# EAGLE design Smarty-TOP (EAGLE 9.5.1)
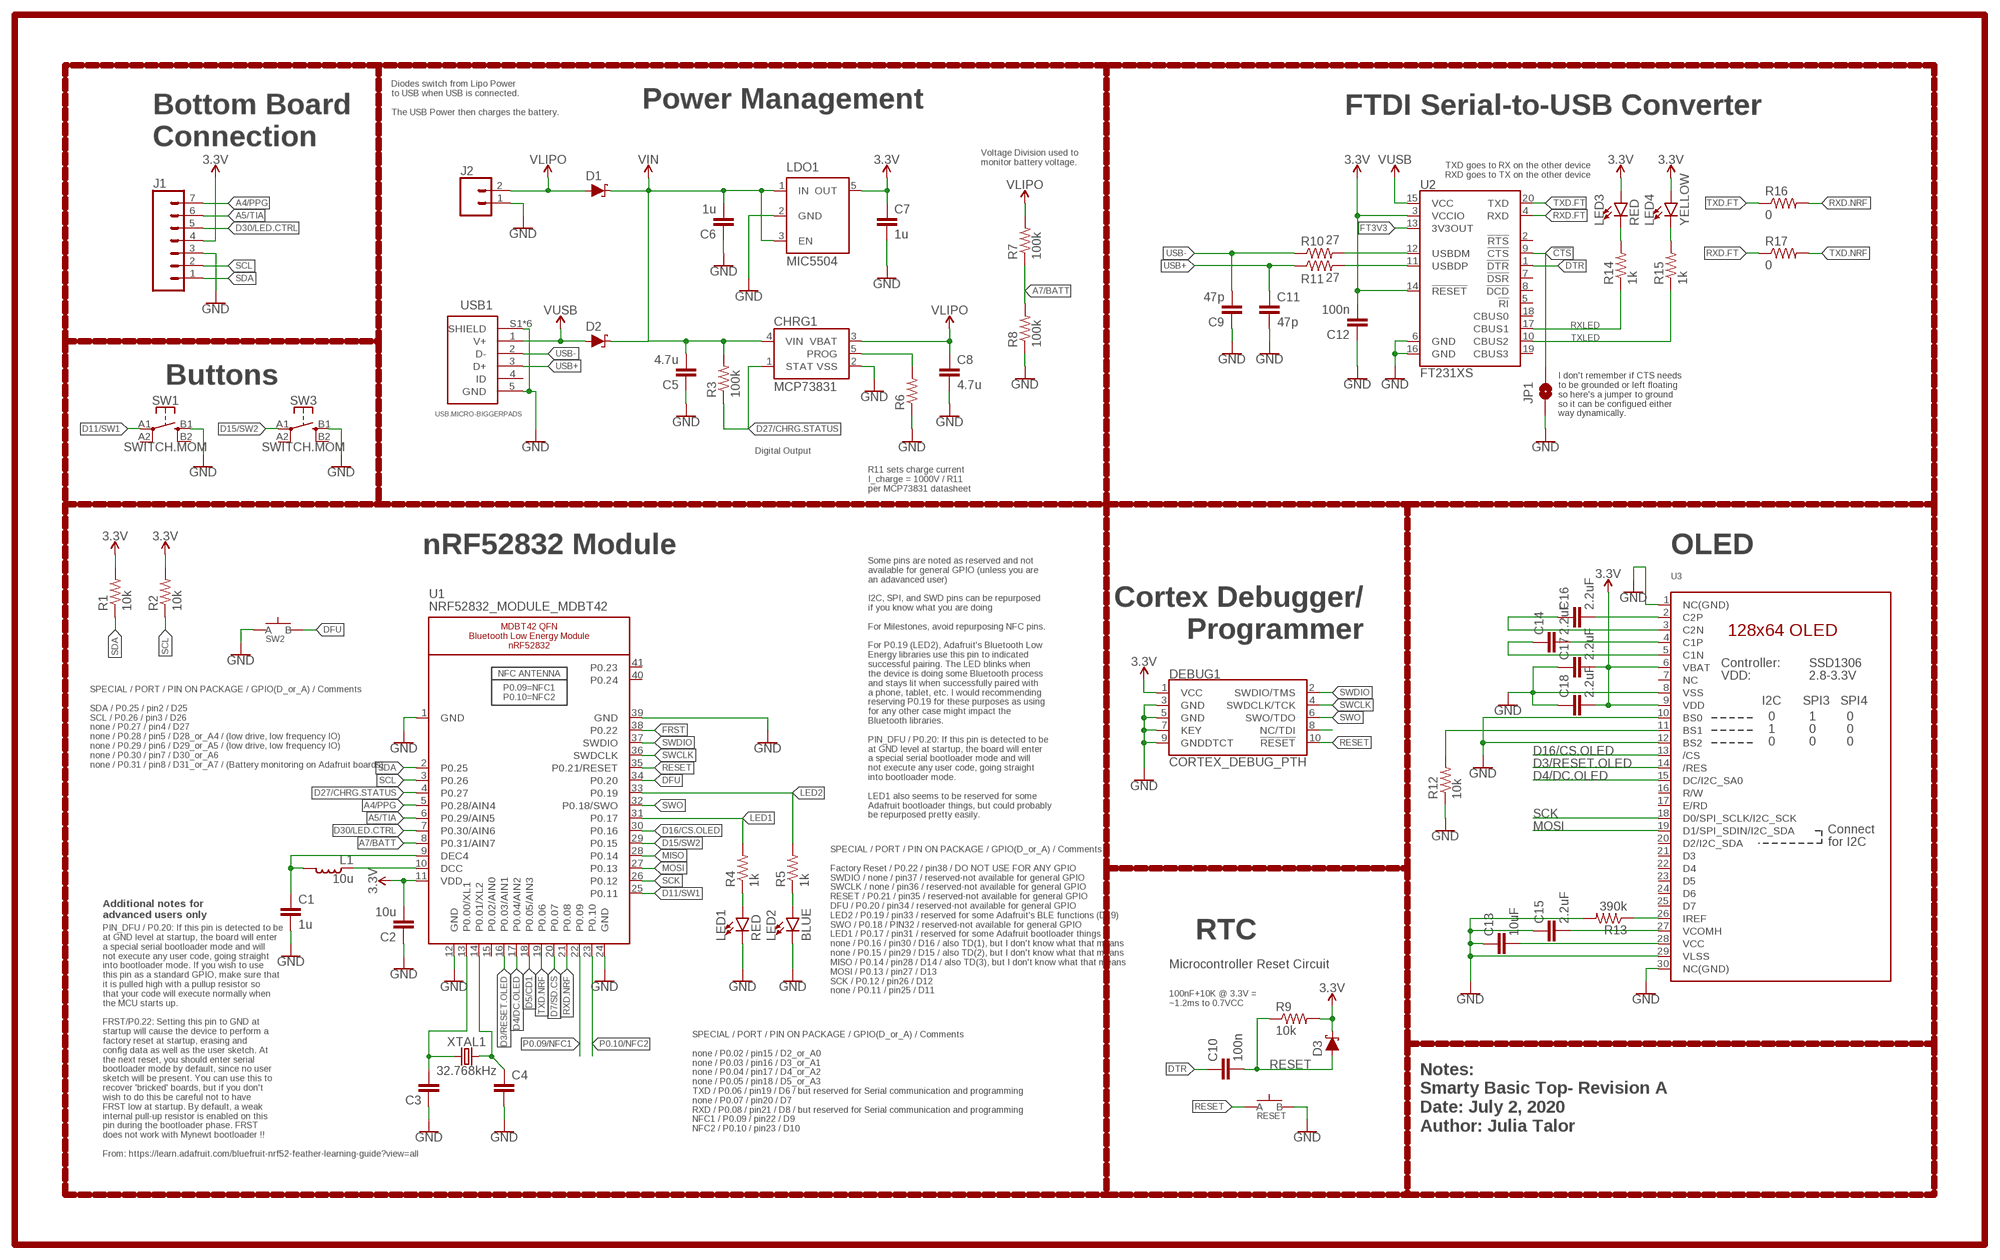
[diagram p0: schematic, sheet 1]

## Parts
C1  1u  CAPACITOR0603  [C0603]
C2  10u  CAPACITOR0805  [C0805]
C3  CAPACITOR0603  [C0603]
C4  CAPACITOR0603  [C0603]
C5  4.7u  CAPACITOR0603  [C0603]
C6  1u  CAPACITOR0603  [C0603]
C7  1u  CAPACITOR0603  [C0603]
C8  4.7u  CAPACITOR0603  [C0603]
C9  47p  CAPACITOR0603  [C0603]
C10  100n  CAPACITOR0603  [C0603]
C11  47p  CAPACITOR0603  [C0603]
C12  100n  CAPACITOR0603  [C0603]
C13  10uF  CAPACITOR0603  [C0603]
C14  2.2uF  CAPACITOR0402  [C0402]
C15  2.2uF  CAPACITOR0603  [C0603]
C16  2.2uF  CAPACITOR0402  [C0402]
C17  2.2uF  CAPACITOR0402  [C0402]
C18  2.2uF  CAPACITOR0402  [C0402]
CHRG1  MCP73831  [SOT23-5]
D1  SCHOTTKY-USC  [USC]
D2  SCHOTTKY-USC  [USC]
D3  SCHOTTKY-USC  [USC]
DEBUG1  CORTEX_DEBUG_PTH  [2X5-PTH-1.27MM]
J1  CONN_07-1.27MM  [1X07_1.27MM]
J2  CONN_02  [1X02]
JP1  JUMPER-SMT_2_NO_SILK  [SMT-JUMPER_2_NO_SILK]
L1  10u  INDUCTOR0603  [L0603]
LDO1  MIC5504  [SOT23-5]
LED1  RED  LED0603  [LED-0603]
LED2  BLUE  LED0603  [LED-0603]
LED3  RED  LED0603  [LED-0603]
LED4  YELLOW  LED0603  [LED-0603]
R1  10k  RESISTOR0603  [R0603]
R2  10k  RESISTOR0603  [R0603]
R3  100k  RESISTOR0603  [R0603]
R4  1k  RESISTOR0603  [R0603]
R5  1k  RESISTOR0603  [R0603]
R6  RESISTOR0603  [R0603]
R7  100k  RESISTOR0603  [R0603]
R8  100k  RESISTOR0603  [R0603]
R9  10k  RESISTOR0603  [R0603]
R10  27  RESISTOR0603  [R0603]
R11  27  RESISTOR0603  [R0603]
R12  10k  RESISTOR0603  [R0603]
R13  390k  RESISTOR0603  [R0603]
R14  1k  RESISTOR0603  [R0603]
R15  1k  RESISTOR0603  [R0603]
R16  0  RESISTOR0603  [R0603]
R17  0  RESISTOR0603  [R0603]
RESET  SPST-PTS830GG140-COPY.1-3  [BUTTON-GULLWING]
SW1  SWITCH.MOM  [TACTILE_SWITCH_SMD_6.2MM_TALL]
SW2  SPST-PTS830GG140-COPY.1-3  [BUTTON-GULLWING]
SW3  SWITCH.MOM  [TACTILE_SWITCH_SMD_6.2MM_TALL]
U1  NRF52832_MODULE_MDBT42  [BLE_MODULE_RAYTAC_MDBT42]
U2  FT231XS  [SSOP20_L]
U3  DISP_OLED_UG-2864HSWEG01-NO-WRAPAROUND  [UG-2864HSWEG01_0.96IN_NO-WRAPAROUND]
USB1  USB.MICRO-BIGGERPADS  [USB-MICRO-01.BIGGERPADS]
XTAL1  32.768kHz  CRYSTALECS-.327-12.5-12-C-TR  [2-SMD.NOLEAD.2.0MMTO1.2MM]

## Nets
3.3V: C2.2 C7.1 C12.2 C17.2 C18.2 D3.-(C) DEBUG1.1(VCC) J1.4 LDO1.5(OUT) LED3.A LED4.A R1.2 R2.2 R9.2 U1.11(VDD) U2.3(VCCIO) U2.14(!RESET) U3.6(VBAT) U3.9(VDD)
!CTS: JP1.2 U2.9(!CTS)
A4/PPG: J1.7 U1.5(P0.28/AIN4)
A5/TIA: J1.6 U1.6(P0.29/AIN5)
A7/BATT: R7.1 R8.2 U1.8(P0.31/AIN7)
D3/RESET.OLED: U1.16(P0.03/AIN1) U3.14(/RES)
D4/DC.OLED: U1.17(P0.04/AIN2) U3.15(DC/I2C_SA0)
D5/CD1: U1.18(P0.05/AIN3)
D7/SD.CS: U1.20(P0.07)
D11/SW1: SW1.A1 U1.25(P0.11)
D15/SW2: SW3.A1 U1.29(P0.15)
D16/CS.OLED: U1.30(P0.16) U3.13(/CS)
D27/CHRG.STATUS: CHRG1.1(STAT) R3.1 U1.4(P0.27)
D30/LED.CTRL: J1.5 U1.7(P0.30/AIN6)
DFU: SW2.3(B) U1.34(P0.20)
DTR: C10.1 U2.1(!DTR)
FRST: U1.38(P0.22)
FT3V3: U2.13(3V3OUT)
GND: C1.2 C2.1 C3.1 C4.2 C5.1 C6.1 C7.2 C8.2 C9.1 C11.2 C12.1 C13.1 C15.1 C17.1 C18.1 CHRG1.2(VSS) DEBUG1.3(GND) DEBUG1.5(GND) DEBUG1.7(KEY) DEBUG1.9(GNDDTCT) J1.3 J2.1 JP1.1 LDO1.2(GND) LED1.C LED2.C R6.1 R8.1 R12.1 R13.2 RESET.3(B) SW1.B1 SW2.1(A) SW3.B1 U1.1(GND) U1.12(GND) U1.24(GND) U1.39(GND) U2.6(GND) U2.16(GND) U3.1(NC(GND)) U3.8(VSS) U3.10(BS0) U3.12(BS2) U3.29(VLSS) U3.30(NC(GND)) USB1.5(GND) USB1.S1(SHIELD) USB1.S2(SHIELD) USB1.S3(SHIELD) USB1.S4(SHIELD) USB1.S5(SHIELD) USB1.S6(SHIELD)
LED1: R4.2 U1.31(P0.17)
LED2: R5.2 U1.33(P0.19)
MISO: U1.28(P0.14)
MOSI: U1.27(P0.13) U3.19(D1/SPI_SDIN/I2C_SDA)
N$1: R12.2 U3.11(BS1)
N$2: R13.1 U3.26(IREF)
N$3: C16.2 U3.2(C2P)
N$4: CHRG1.5(PROG) R6.2
N$5: C16.1 U3.3(C2N)
N$7: C14.2 U3.4(C1P)
N$8: C14.1 U3.5(C1N)
N$11: R10.2 U2.12(USBDM)
N$12: R11.2 U2.11(USBDP)
N$13: C13.2 U3.28(VCC)
N$14: LED3.C R14.2
N$15: C15.2 U3.27(VCOMH)
N$16: LED4.C R15.2
N$26: C3.2 U1.13(P0.00/XL1) XTAL1.P$1
N$27: C4.1 U1.14(P0.01/XL2) XTAL1.P$2
N$28: LED1.A R4.1
N$29: LED2.A R5.1
N$30: L1.1 U1.10(DCC)
N$31: C1.1 L1.2 U1.9(DEC4)
N$32: DEBUG1.8(NC/TDI)
P0.09/NFC1: U1.22(P0.09)
P0.10/NFC2: U1.23(P0.10)
RESET: C10.2 D3.+(A) DEBUG1.10(!RESET) R9.1 RESET.1(A) U1.35(P0.21/RESET)
RXD.FT: R17.1 U2.4(RXD)
RXD.NRF: R16.2 U1.21(P0.08)
RXLED: R14.1 U2.17(CBUS1)
SCK: U1.26(P0.12) U3.18(D0/SPI_SCLK/I2C_SCK)
SCL: J1.2 R2.1 U1.3(P0.26)
SDA: J1.1 R1.1 U1.2(P0.25)
SWCLK: DEBUG1.4(SWDCLK/TCK) U1.36(SWDCLK)
SWDIO: DEBUG1.2(SWDIO/TMS) U1.37(SWDIO)
SWO: DEBUG1.6(SWO/TDO) U1.32(P0.18/SWO)
TXD.FT: R16.1 U2.20(TXD)
TXD.NRF: R17.2 U1.19(P0.06)
TXLED: R15.1 U2.10(CBUS2)
USB+: C11.1 R11.1 USB1.3(D+)
USB-: C9.2 R10.1 USB1.2(D-)
V_USB: D2.+(A) U2.15(VCC) USB1.1(V+) ; supply symbol labelled VUSB
VIN: C5.2 C6.2 CHRG1.4(VIN) D1.-(C) D2.-(C) LDO1.1(IN) LDO1.3(EN) R3.2
VLIPO: C8.1 CHRG1.3(VBAT) D1.+(A) J2.2 R7.2
Unconnected: SW1.A2 SW1.B2 SW3.A2 SW3.B2 U1.15(P0.02/AIN0) U1.40(P0.24) U1.41(P0.23) U2.2(!RTS) U2.5(!RI) U2.7(!DSR) U2.8(!DCD) U2.18(CBUS0) U2.19(CBUS3) U3.7(NC) U3.16(R/W) U3.17(E/RD) U3.20(D2/I2C_SDA) U3.21(D3) U3.22(D4) U3.23(D5) U3.24(D6) U3.25(D7) USB1.4(ID)

## Notes on the sheet
- Power Management
- Diodes switch from Lipo Power 
  to USB when USB is connected.
  
  The USB Power then charges the battery.
- FTDI Serial-to-USB Converter
- Bottom Board 
  Connection
- Voltage Division used to 
  monitor battery voltage.
- TXD goes to RX on the other device
  RXD goes to TX on the other device
- Buttons
- I don't remember if CTS needs
  to be grounded or left floating
  so here's a jumper to ground
  so it can be configued either
  way dynamically.
- Digital Output
- R11 sets charge current
  I_charge = 1000V / R11
  per MCP73831 datasheet
- nRF52832 Module | OLED
- Cortex Debugger/
  Programmer
- SPECIAL / PORT / PIN ON PACKAGE / GPIO(D_or_A) / Comments
  
  SDA / P0.25 / pin2 / D25
  SCL / P0.26 / pin3 / D26
  none / P0.27 / pin4 / D27
  none / P0.28 / pin5 / D28_or_A4 / (low drive, low frequency IO)
  none / P0.29 / pin6 / D29_or_A5 / (low drive, low frequency IO)
  none / P0.30 / pin7 / D30_or_A6
  none / P0.31 / pin8 / D31_or_A7 / (Battery monitoring on Adafruit boards)
- Some pins are noted as reserved and not
  available for general GPIO (unless you are
  an adavanced user)
  
  I2C, SPI, and SWD pins can be repurposed
  if you know what you are doing
  
  For Milestones, avoid repurposing NFC pins.
  
  For P0.19 (LED2), Adafruit's Bluetooth Low
  Energy libraries use this pin to indicated
  successful pairing. The LED blinks when
  the device is doing some Bluetooth process
  and stays lit when successfully paired with
  a phone, tablet, etc. I would recommending
  reserving P0.19 for these purposes as using
  for any other case might impact the
  Bluetooth libraries.
  
  PIN_DFU / P0.20: If this pin is detected to be
  at GND level at startup, the board will enter
  a special serial bootloader mode and will
  not execute any user code, going straight
  into bootloader mode.
  
  LED1 also seems to be reserved for some
  Adafruit bootloader things, but could probably
  be repurposed pretty easily.
- Additional notes for
  advanced users only
- RTC
- Microcontroller Reset Circuit
- SPECIAL / PORT / PIN ON PACKAGE / GPIO(D_or_A) / Comments
  
  Factory Reset / P0.22 / pin38 / DO NOT USE FOR ANY GPIO
  SWDIO / none / pin37 / reserved-not available for general GPIO
  SWCLK / none / pin36 / reserved-not available for general GPIO
  RESET / P0.21 / pin35 / reserved-not available for general GPIO
  DFU / P0.20 / pin34 / reserved-not available for general GPIO
  LED2 / P0.19 / pin33 / reserved for some Adafruit's BLE functions (D19)
  SWO / P0.18 / PIN32 / reserved-not available for general GPIO
  LED1 / P0.17 / pin31 / reserved for some Adafruit bootloader things
  none / P0.16 / pin30 / D16 / also TD(1), but I don't know what that means
  none / P0.15 / pin29 / D15 / also TD(2), but I don't know what that means
  MISO / P0.14 / pin28 / D14 / also TD(3), but I don't know what that means
  MOSI / P0.13 / pin27 / D13
  SCK / P0.12 / pin26 / D12
  none / P0.11 / pin25 / D11
- 100nF+10K @ 3.3V =
  ~1.2ms to 0.7VCC
- SPECIAL / PORT / PIN ON PACKAGE / GPIO(D_or_A) / Comments
  
  none / P0.02 / pin15 / D2_or_A0
  none / P0.03 / pin16 / D3_or_A1
  none / P0.04 / pin17 / D4_or_A2
  none / P0.05 / pin18 / D5_or_A3
  TXD / P0.06 / pin19 / D6 / but reserved for Serial communication and programming
  none / P0.07 / pin20 / D7
  RXD / P0.08 / pin21 / D8 / but reserved for Serial communication and programming
  NFC1 / P0.09 / pin22 / D9
  NFC2 / P0.10 / pin23 / D10
- Notes:
  Smarty Basic Top- Revision A
  Date: July 2, 2020
  Author: Julia Talor
- PIN_DFU / P0.20: If this pin is detected to be
  at GND level at startup, the board will enter
  a special serial bootloader mode and will
  not execute any user code, going straight
  into bootloader mode. If you wish to use
  this pin as a standard GPIO, make sure that
  it is pulled high with a pullup resistor so
  that your code will execute normally when
  the MCU starts up.
  
  FRST/P0.22: Setting this pin to GND at
  startup will cause the device to perform a
  factory reset at startup, erasing and
  config data as well as the user sketch. At
  the next reset, you should enter serial
  bootloader mode by default, since no user
  sketch will be present. You can use this to
  recover 'bricked' boards, but if you don't
  wish to do this be careful not to have
  FRST low at startup. By default, a weak
  internal pull-up resistor is enabled on this
  pin during the bootloader phase. FRST
  does not work with Mynewt bootloader !!
  
  From: https://learn.adafruit.com/bluefruit-nrf52-feather-learning-guide?view=all

## Library data of the parts
C1-C18 = LinnesLab-Passives:CAPACITOR
CHRG1 = LinnesLab-Power:MCP73831: MCP73831T Li-Ion, Li-Pol Controller Miniature single cell, fully integrated Li-Ion, Li-polymer charge management controller Datasheet <http://ww1.microchip.com/downloads/en/DeviceDoc/20001984g.pdf> SparkFun Products: SparkFun ESP32 Thing <https://www.sparkfun.com/products/13907> SparkFun 9DoF Razor IMU M0 <https://www.sparkfun.com/products/14001>; PROD_ID: IC-09995
D1-D3 = LinnesLab-DiscreteSemi:SCHOTTKY: Schottky diode A Schottky diode is a semiconductor diode which has a low forward voltage drop and a very fast switching action. Example: Digi-Key Part Number: RB161MM-20CT-ND
DEBUG1 = LinnesLab-Connectors:CORTEX_DEBUG: Cortex Debug Connector - 10 pin Supports JTAG debug, Serial Wire debug, and Serial Wire Viewer. PTH and SMD connector options available. General Connector Information <http://infocenter.arm.com/help/topic/com.arm.doc.faqs/attached/13634/cortex_debug_connectors.pdf> Products: PTH Connector <http://www.digikey.com/product-detail/en/cnc-tech/3220-10-0100-00/1175-1627-ND/3883661> -via Digi-Key SparkFun PSoc <https://www.sparkfun.com/products/13229> SparkFun T <https://www.sparkfun.com/products/13810>
J1 = LinnesLab-Connectors:CONN_07: Multi connection point. Often used as Generic Header-pin footprint for 0.1 inch spaced/style header connections On any of the 0.1 inch spaced packages, you can populate with these: Break Away Headers - Straight <https://www.sparkfun.com/products/116> (PRT-00116) Break Away Male Headers - Right Angle <https://www.sparkfun.com/products/553> (PRT-00553) Female Headers <https://www.sparkfun.com/products/115> (PRT-00115) Break Away Headers - Machine Pin <https://www.sparkfun.com/products/117> (PRT-00117) Break Away Female Headers - Swiss Machine Pin <https://www.sparkfun.com/products/743> (PRT-00743) For SCREWTERMINALS and SPRING TERMINALS visit here: Screw Terimnals on SparkFun.com <https://www.sparkfun.com/search/results?term=Screw+Terminals> (5mm/3.5mm/2.54mm spacing) This device is also useful as a general connection point to wire up your design to another part of your project. Our various solder wires solder well into these plated through hole pads. Hook-Up Wire - Assortment (Stranded, 22 AWG) <https://www.sparkfun.com/products/11375> (PRT-11375) Hook-Up Wire - Assortment (Solid Core, 22 AWG) <https://www.sparkfun.com/products/11367> (PRT-11367) View the entire wire category on our website here <https://www.sparkfun.com/categories/141> Special notes: Molex polarized connector foot print use with SKU : PRT-08231 with associated crimp pins and housings. 1MM SMD Version SKU: PRT-10208 NOTES ON THE VARIANTS LOCK and LOCK_LONGPADS... This footprint was designed to help hold the alignment of a through-hole component (i.e. 6-pin header) while soldering it into place. You may notice that each hole has been shifted either up or down by 0.005 of an inch from it's more standard position (which is a perfectly straight line). This slight alteration caused the pins (the squares in the middle) to touch the edges of the holes. Because they are alternating, it causes a "brace" to hold the component in place. 0.005 has proven to be the perfect amount of "off-center" position when using our standard breakaway headers. Although looks a little odd when you look at the bare footprint, once you have a header in there, the alteration is very hard to notice. Also,if you push a header all the way into place, it is covered up entirely on the bottom side.
J2 = LinnesLab-Connectors:CONN_02: Multi connection point. Often used as Generic Header-pin footprint for 0.1 inch spaced/style header connections On any of the 0.1 inch spaced packages, you can populate with these: Break Away Headers - Straight <https://www.sparkfun.com/products/116> (PRT-00116) Break Away Male Headers - Right Angle <https://www.sparkfun.com/products/553> (PRT-00553) Female Headers <https://www.sparkfun.com/products/115> (PRT-00115) Break Away Headers - Machine Pin <https://www.sparkfun.com/products/117> (PRT-00117) Break Away Female Headers - Swiss Machine Pin <https://www.sparkfun.com/products/743> (PRT-00743) For SCREWTERMINALS and SPRING TERMINALS visit here: Screw Terimnals on SparkFun.com <https://www.sparkfun.com/search/results?term=Screw+Terminals> (5mm/3.5mm/2.54mm spacing) This device is also useful as a general connection point to wire up your design to another part of your project. Our various solder wires solder well into these plated through hole pads. Hook-Up Wire - Assortment (Stranded, 22 AWG) <https://www.sparkfun.com/products/11375> (PRT-11375) Hook-Up Wire - Assortment (Solid Core, 22 AWG) <https://www.sparkfun.com/products/11367> (PRT-11367) View the entire wire category on our website here <https://www.sparkfun.com/categories/141> Special notes: Molex polarized connector foot print use with: PRT-08233 with associated crimp pins and housings. 2.54_SCREWTERM for use with PRT-10571. 3.5mm Screw Terminal footprints for PRT-08084 5mm Screw Terminal footprints for use with PRT-08432
JP1 = LinnesLab-Switches:JUMPER-SMT_2_NO: Normally open jumper This jumper has two pads in close proximity to each other. Apply solder to close the connection. Round pads are easier to solder for beginners, but are a lot larger. SparkFun Product that uses the round pads: SparkFun EL Sequencer <https://www.sparkfun.com/products/12781>
L1 = LinnesLab-Passives:INDUCTOR
LDO1 = LinnesLab-Power:MIC5504: MIC5504 Voltage Regulator Output Voltages: 1.0V to 3.3V Input Voltages: 2.5V to 5.5V Link to Datasheet http://ww1.microchip.com/downloads/en/DeviceDoc/MIC550X.pdf
LED1-LED4 = LinnesLab-LED:LED: LED (Generic) Standard schematic elements and footprints for 5mm, 3mm, 1206, and 0603 sized LEDs. Generic LEDs with no color specified. LTST-C190KGKT: arrow indicates cathode
R1-R17 = LinnesLab-Passives:RESISTOR
RESET SW2 = LinnesLab-Switches:SPST-PTS830GG140-COPY
SW1 SW3 = LinnesLab-Switches:SWITCH.MOM: PTS645SM43SMTR92 LFS
U1 = LinnesLab-Microcontrollers:NRF52832_MODULE_MDBT42: MDBT42 - BLE Module (nRF52832 QFN) VDD: 1.7-3.6V
U2 = LinnesLab-DigitalIC:FT231X: FTDI FT231X Full Speed USB to Full-handshake UART This USB2.0 Full Speed IC offers a compact bridge to full handshake UART interfaces. The device is a UART, capable of operating up to 3MBaud, with low power consumption (8mA). The FT231X includes the complete FT-X series feature set and enables USB to be added into a system design quickly and easily over a UART interface. Datasheet <http://cdn.sparkfun.com/datasheets/Components/General%20IC/DS_FT231X.pdf>; DIGIKEY: 768-1156-5-ND; MFN: FT231XS-U
U3 = LinnesLab-Displays:DISP_OLED_UG-2864HSWEG01: UG-2864HSWEG01 OLED display Both 1.3" and 0.96" models share the same FPC tab footprint, only the screen dimensions vary.
USB1 = LinnesLab-Connectors:USB.MICRO: DigiKey PN: 609-4613-1-ND
XTAL1 = LinnesLab-Clocks:CRYSTAL

## Board
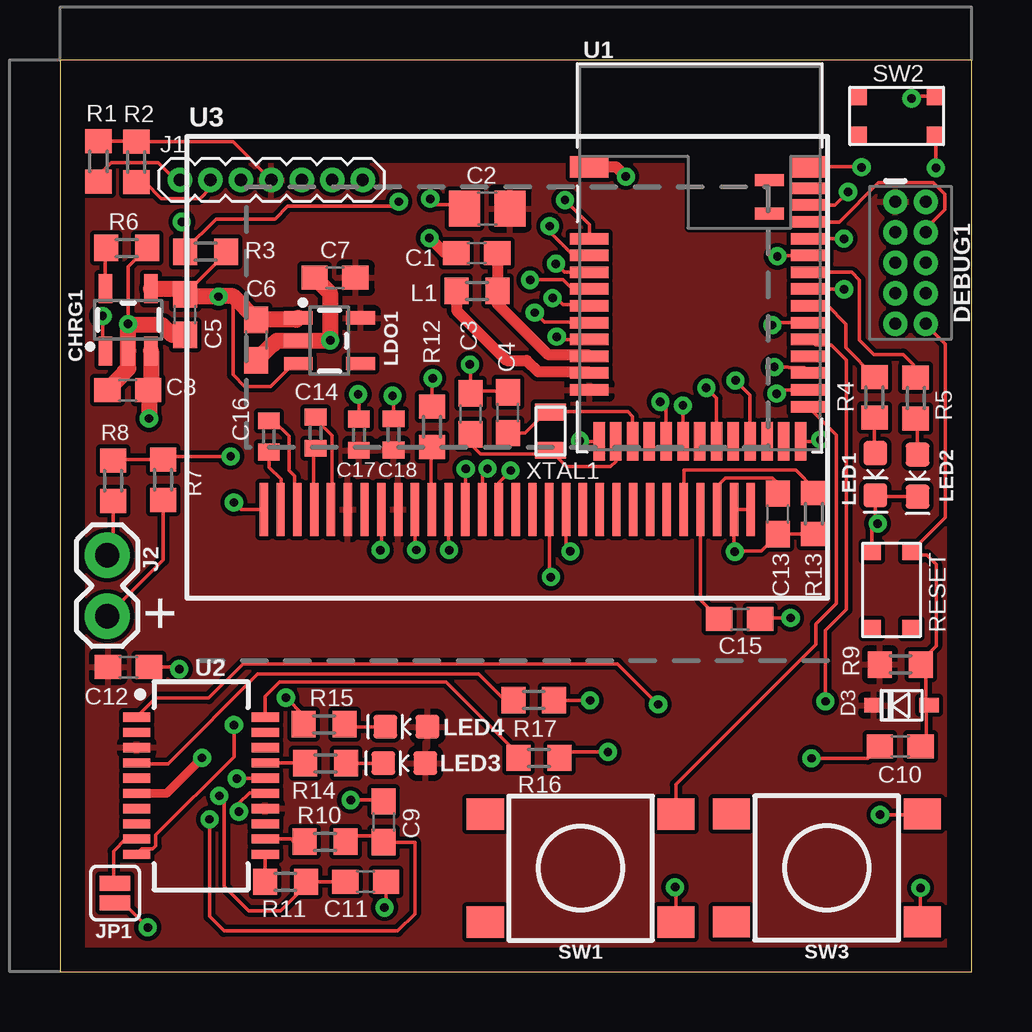
[diagram p1: board, top side]
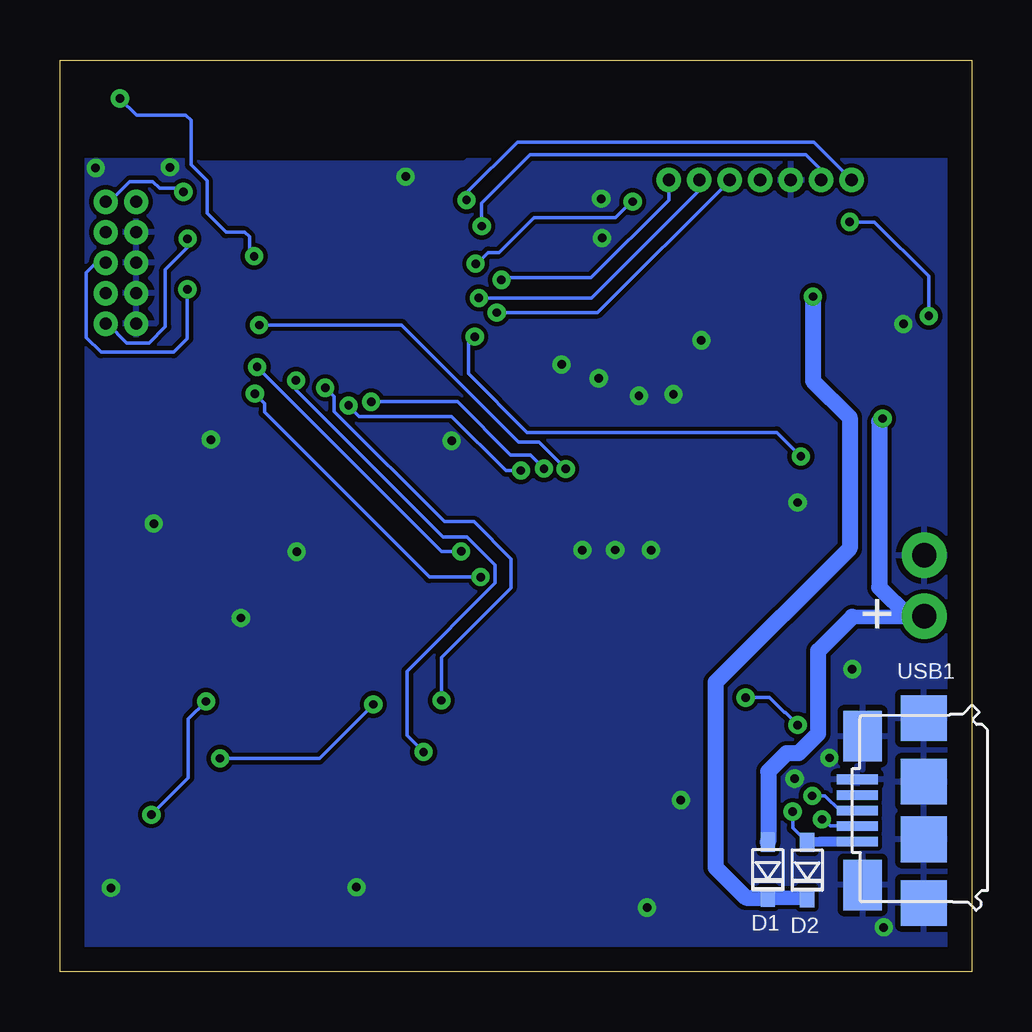
[diagram p2: board, bottom side, seen from below]

Size 38 x 38 mm. Coordinates in mm from the lower left corner, seen from the top.
Outline: 0,0 38,0 38,38 0,38 0,0
Copper layers (1*16): Top 0.035mm / dielectric 1.5mm / Bottom 0.035mm
Design rules "default": minimum track width 6mil, minimum drill 0.35mm, track to track 6mil, track to pad 6mil, pad to pad 6mil, via to via 6mil, smd to smd 6mil, copper to edge 40mil, drill to drill 6mil, minimum pad ring 10mil, minimum via ring 8mil, stop-mask expansion 4mil, vias tented up to drill 0mil, thermal gap 10mil

### Footprints (pad centres in the part's own frame; a part is rotated, then mirrored left to right if it is on the bottom)
C0603 = smd 1.1 x 1: 1 -0.85,0; 2 0.85,0
C0805 = smd 1.3 x 1.5: 1 -0.95,0; 2 0.95,0
C0402 = smd 0.7 x 0.9: 1 -0.65,0; 2 0.65,0
SOT23-5 = smd 0.55 x 1.2: 1 -0.95,-1.3; 2 0,-1.3; 3 0.95,-1.3; 4 0.95,1.3; 5 -0.95,1.3
USC = smd 0.8 x 0.6: + -1.15,0; - 1.15,0
2X5-PTH-1.27MM = drill 0.508 pad 1: 1 -2.54,-0.635; 2 -2.54,0.635; 3 -1.27,-0.635; 4 -1.27,0.635; 5 0,-0.635; 6 0,0.635; 7 1.27,-0.635; 8 1.27,0.635; 9 2.54,-0.635; 10 2.54,0.635
1X07_1.27MM = drill 0.508 pad 1: 1 0,0; 2 1.27,0; 3 2.54,0; 4 3.81,0; 5 5.08,0; 6 6.35,0; 7 7.62,0
1X02 = drill 1.016 pad 1.88: 1 0,0; 2 2.54,0
SMT-JUMPER_2_NO_SILK = smd 0.635 x 1.27: 1 -0.406,0; 2 0.406,0
L0603 = smd 1 x 1.1: 1 -0.85,0; 2 0.85,0
LED-0603 = smd 1 x 1: A -0.877,0; C 0.877,0
R0603 = smd 1 x 1.1: 1 -0.85,0; 2 0.85,0
BUTTON-GULLWING = smd 0.7 x 0.75: 1 -1.6,0.825; 2 1.6,0.825; 3 -1.6,-0.825; 4 1.6,-0.825
TACTILE_SWITCH_SMD_6.2MM_TALL = smd 1.55 x 1.3: A1 -3.975,-2.25; A2 3.975,-2.25; B1 -3.975,2.25; B2 3.975,2.25
BLE_MODULE_RAYTAC_MDBT42 = smd 1.6 x 0.9: 1 -4.6,3.8; 39 4.6,3.8 | smd 1.6 x 0.48: 2 -4.6,0.8; 3 -4.6,0.1; 4 -4.6,-0.6; 5 -4.6,-1.3; 6 -4.6,-2; 7 -4.6,-2.7; 8 -4.6,-3.4; 9 -4.6,-4.1; 10 -4.6,-4.8; 11 -4.6,-5.5; 25 4.6,-6.2; 26 4.6,-5.5; 27 4.6,-4.8; 28 4.6,-4.1; 29 4.6,-3.4; 30 4.6,-2.7; 31 4.6,-2; 32 4.6,-1.3; 33 4.6,-0.6; 34 4.6,0.1; 35 4.6,0.8; 36 4.6,1.5; 37 4.6,2.2; 38 4.6,2.9 | smd 0.48 x 1.6: 12 -4.2,-7.65; 13 -3.5,-7.65; 14 -2.8,-7.65; 15 -2.1,-7.65; 16 -1.4,-7.65; 17 -0.7,-7.65; 18 0,-7.65; 19 0.7,-7.65; 20 1.4,-7.65; 21 2.1,-7.65; 22 2.8,-7.65; 23 3.5,-7.65; 24 4.2,-7.65 | smd 1.2 x 0.5: 40 2.9,3.25; 41 2.9,1.85
SSOP20_L = smd 0.381 x 1.143: 1 -2.857,-2.68; 2 -2.223,-2.68; 3 -1.587,-2.68; 4 -0.953,-2.68; 5 -0.318,-2.68; 6 0.318,-2.68; 7 0.953,-2.68; 8 1.587,-2.68; 9 2.223,-2.68; 10 2.857,-2.68; 11 2.857,2.68; 12 2.223,2.68; 13 1.587,2.68; 14 0.953,2.68; 15 0.318,2.68; 16 -0.318,2.68; 17 -0.953,2.68; 18 -1.587,2.68; 19 -2.223,2.68; 20 -2.857,2.68
UG-2864HSWEG01_0.96IN_NO-WRAPAROUND = smd 0.35 x 2.2: 1 -10.15,-1.2; 2 -9.45,-1.2; 3 -8.75,-1.2; 4 -8.05,-1.2; 5 -7.35,-1.2; 6 -6.65,-1.2; 7 -5.95,-1.2; 8 -5.25,-1.2; 9 -4.55,-1.2; 10 -3.85,-1.2; 11 -3.15,-1.2; 12 -2.45,-1.2; 13 -1.75,-1.2; 14 -1.05,-1.2; 15 -0.35,-1.2; 16 0.35,-1.2; 17 1.05,-1.2; 18 1.75,-1.2; 19 2.45,-1.2; 20 3.15,-1.2; 21 3.85,-1.2; 22 4.55,-1.2; 23 5.25,-1.2; 24 5.95,-1.2; 25 6.65,-1.2; 26 7.35,-1.2; 27 8.05,-1.2; 28 8.75,-1.2; 29 9.45,-1.2; 30 10.15,-1.2
USB-MICRO-01.BIGGERPADS = smd 0.4 x 1.7: 1 -1.3,1.505; 2 -0.65,1.505; 3 0,1.505; 4 0.65,1.505; 5 1.3,1.505 | smd 1.9 x 1.9: S1 -3.85,-1.27; S2 -1.2,-1.27; S3 1.2,-1.27; S4 3.85,-1.27 | smd 2.1 x 1.6: S5 -3.1,1.28; S6 3.1,1.28
2-SMD.NOLEAD.2.0MMTO1.2MM = smd 0.7 x 1.3: P$1 -0.8,0; P$2 0.8,0

### Placement (x,y rotation side)
C1  17.38,29.95 180 top
C2  17.81,31.8 0 top
C3  17.11,23.25 270 top
C4  18.68,23.3 90 top
C5  5.22,27.39 90 top
C6  8.19,26.32 90 top
C7  11.47,28.92 180 top
C8  2.83,24.24 180 top
C9  13.48,6.24 270 top
C10  35.03,9.38 0 top
C11  12.75,3.74 0 top
C12  2.85,12.7 180 top
C13  29.92,19.08 90 top
C14  10.66,22.46 270 top
C15  28.34,14.69 180 top
C16  8.71,22.31 270 top
C17  12.47,22.38 270 top
C18  13.91,22.39 270 top
CHRG1  2.84,27.17 0 top
D1  8.49,4.24 270 bottom
D2  6.85,4.23 270 bottom
D3  35.08,11.1 180 top
DEBUG1  35.46,29.55 270 top
J1  5,33 0 top
J2  1.97,17.35 270 top
JP1  2.3,3.27 90 top
L1  17.39,28.37 0 top
LDO1  11.23,26.3 270 top
LED1  33.99,20.73 270 top
LED2  35.75,20.67 270 top
LED3  14.35,8.68 180 top
LED4  14.44,10.21 180 top
R1  1.6,33.77 90 top
R2  3.18,33.75 90 top
R3  6.08,30 0 top
R4  33.95,23.93 90 top
R5  35.67,23.91 90 top
R6  2.78,30.16 180 top
R7  4.3,20.5 270 top
R8  2.22,20.46 90 top
R9  35.04,12.8 180 top
R10  11.05,5.41 180 top
R11  9.4,3.74 180 top
R12  15.51,22.71 270 top
R13  31.43,19.09 270 top
R14  11.07,8.68 0 top
R15  11.01,10.3 0 top
R16  19.97,8.91 0 top
R17  19.75,11.32 0 top
RESET  34.66,15.91 270 top
SW1  21.7,4.31 180 top
SW2  34.88,35.67 180 top
SW3  31.97,4.32 180 top
U1  26.67,29.75 0 top
U2  5.88,7.75 270 top
U3  18.65,20.45 0 top
USB1  3.26,6.71 90 bottom
XTAL1  20.45,22.53 90 top

### Tracks (layer width: path | path; a pad name or v marks a point on that pad's centre or on a via)
3.3V
  Top 0.152: DEBUG1.1 34.71,32.09 | R1.2 3.16,34.62 R2.2 7.21,34.6 J1.4
  pour Top (isolate 0.178): 0.2,33.63 37.83,33.63 37.83,0.45 0.2,0.45
!CTS
  Top 0.152: U2.9 2.74,5.52 2.23,5.01 2.23,3.74 JP1.2
A4/PPG  (via drill 0.35)
  Top 0.152: v19.6,28.83 v19.6,28.84 20.97,28.84 21.36,28.45 U1.5
  Bottom 0.152: J1.7 12.62,32.16 15.86,28.93 19.5,28.93 v19.6,28.83
A5/TIA  (via drill 0.35)
  Top 0.152: U1.6 22.01,27.81 20.97,27.81 20.62,28.16 v20.54,28.08
  Bottom 0.152: v20.54,28.08 15.85,28.08 11.35,32.58 J1.6
A7/BATT  (via drill 0.35)
  Top 0.152: R8.2 2.26,21.35 R7.1 4.43,21.48 v7.12,21.48 | U1.8 20.82,26.35 v20.71,26.46
  Bottom 0.152: v20.71,26.46 20.97,26.21 20.97,24.93 18.52,22.48 8.12,22.48 v7.12,21.48
D3/RESET.OLED  (via drill 0.35)
  Top 0.152: U3.14 17.62,19.27 17.62,20.76 v17.82,20.96 | v25.03,23.75 25.27,23.51 U1.16
  Bottom 0.152: v17.82,20.96 18.39,21.53 19.21,21.53 21.43,23.75 v25.03,23.75 | v25.03,23.75
D4/DC.OLED  (via drill 0.35)
  Top 0.152: U3.15 18.3,20.4 v18.79,20.89 | v25.97,23.6 U1.17
  Bottom 0.152: v25.97,23.6 25.97,23.58 25.54,23.14 21.67,23.14 19.41,20.89 v18.79,20.89
D11/SW1
  Top 0.152: U1.25 31.27,23.47 32.37,22.37 32.37,15.34 31.51,14.48 31.51,13.63 25.68,7.79 SW1.A1
D15/SW2  (via drill 0.35)
  Top 0.152: SW3.A1 35.91,6.54 v34.19,6.54 | U1.29 31.5,26.12 32.16,26.12 32.79,25.49 32.79,15.09 31.91,14.22 v31.91,11.26
  Bottom 0.152: v34.19,6.54 32.65,8.08 32.65,10.53 v31.91,11.26
D16/CS.OLED  (via drill 0.35)
  Top 0.152: U3.13 16.9,20.94 v16.91,20.95 | v29.7,26.95 29.79,27.05 U1.30
  Bottom 0.152: v16.91,20.95 18.04,22.07 18.88,22.07 23.75,26.95 v29.7,26.95
D27/CHRG.STATUS  (via drill 0.35)
  Top 0.152: v5.08,31.25 5.23,31.1 R3.1 5.23,30.08 6.51,31.37 8.96,31.37 9.49,31.9 13.84,31.9 14.04,32.09 v14.12,32.09 | v1.78,27.32 1.78,25.98 CHRG1.1 | U1.4 21.03,29.15 v20.67,29.5
  Bottom 0.152: v5.08,31.25 4.05,31.25 1.78,28.98 v1.78,27.32 | v20.67,29.5 20.62,29.5 20.15,29.97 19.7,29.97 18.25,31.43 14.84,31.43 14.17,32.09 v14.12,32.09
D30/LED.CTRL  (via drill 0.35)
  Top 0.152: U1.7 22.05,27.07 20.19,27.07 v19.79,27.47
  Bottom 0.152: v19.79,27.47 15.59,27.47 10.08,32.98 J1.5
DFU  (via drill 0.35)
  Top 0.152: U1.34 29.94,29.85 v29.91,29.82 | v35.5,36.39 35.6,36.49 SW2.3
  Bottom 0.152: v29.91,29.82 30.1,30.01 30.1,30.63 30.3,30.82 31.07,30.82 31.87,31.62 31.87,32.96 32.53,33.63 32.53,35.49 32.75,35.71 34.53,35.71 34.54,35.69 34.8,35.69 v35.5,36.39
DTR  (via drill 0.35)
  Top 0.152: v24.93,11.13 23.25,12.82 7.63,12.82 6.2,11.4 3.99,11.4 U2.1 | C10.1 33.68,8.88 v31.33,8.88
  Bottom 0.152: v31.33,8.88 27.19,8.88 v24.93,11.13
GND  (via drill 0.35)
  Top 0.152: v7.25,19.55 7.55,19.25 U3.1 | 13.88,23.01 C18.1 13.91,23.96 v13.87,24 | v12.43,24.06 12.47,24.02 C17.1 | C12.1 5.08,12.7 v4.98,12.61 | C11.2 13.6,2.74 v13.53,2.67 | J2.1 2.22,17.61 R8.1 | 14.74,19.2 U3.10 14.8,17.63 v14.86,17.57 | U3.12 16.2,17.59 v16.22,17.57 | U3.8 13.4,17.61 v13.36,17.57 | 28.84,19.22 U3.30 U3.29 28.1,17.54 | C9.1 13.43,7.15 v12.12,7.15 | 28.1,17.54 v28.13,17.5 | v15.54,24.73 15.51,24.7 R12.1 | 16.85,24.35 C3.1 | C4.2 18.52,24.15 18.46,24.2 17.22,24.2 C3.1 | v17.09,25.31 17.11,25.29 C3.1 | U1.12 21.7,22.1 v21.67,22.13 | R13.2 29.93,18.24 C13.1 29.23,17.54 28.1,17.54 | LED2.C 34.05,19.8 LED1.C 33.99,18.77 v34.09,18.67 33.84,18.42 RESET.3 | U1.24 31.63,22.1 v31.71,22.17 | v33.42,33.52 33.4,33.55 U1.39 | SW2.1 36.51,34.81 v36.51,33.5 | C15.1 29.23,14.74 v30.46,14.74 | SW1.B1 25.68,3.48 v25.64,3.52 | SW3.B1 35.87,2.14 v35.87,3.49 | C2.1 16.7,31.97 15.8,31.97 15.68,31.97 v15.44,32.21 | U2.16 8.54,8.04 v7.38,8.04 | JP1.1 2.64,2.87 v3.66,1.84 | R6.1 2.85,29.38 2.85,26.99
  Top 0.356: U2.6 4.45,7.43 v5.92,8.91
  Top 0.457: C1.2 16.05,29.95 15.42,30.58 v15.4,30.58 | U1.1 23.18,33.55 v23.59,33.14
  Top 0.66: 2.85,26.99 CHRG1.2 2.85,25.14 2.64,24.94 2.64,24.91 C8.2 | 2.85,26.99 v2.84,27 | 2.85,26.99 2.88,26.95 4.27,26.95 4.68,26.54 C5.1 | C7.2 11.25,28.28 11.25,26.3 | C6.1 8.85,26.14 8.89,26.14 9.05,26.3 LDO1.2 11.25,26.3 | 11.25,26.3 v11.27,26.31
  pour Bottom (isolate 0.178): 0.38,33.85 37.88,33.85 37.88,0.39 36.03,0.39 35.99,0.35 0.38,0.35
LED1
  Top 0.152: R4.2 33.95,24.81 32.76,26.01 32.76,27 31.98,27.78 31.3,27.78 U1.31
LED2
  Top 0.152: U1.33 33.01,29.15 33.33,28.83 33.33,26.32 33.93,25.72 35.16,25.72 35.58,25.3 35.58,24.86 R5.2
MOSI  (via drill 0.35)
  Top 0.152: U3.19 21.1,17.69 v21.27,17.51 | v29.78,25.2 30.35,25.2 30.38,25.18 31.04,25.18 U1.27
  Bottom 0.152: v21.27,17.51 22.09,17.51 29.46,24.89 29.47,24.89 v29.78,25.2
N$1
  Top 0.152: R12.2 15.47,21.81 15.47,19.29 U3.11
N$2
  Top 0.152: U3.26 26.01,19.27 26.01,20.9 30.67,20.9 31.43,20.14 R13.1
N$3
  Top 0.152: U3.2 9.2,19.34 9.21,19.35 9.21,20.52 8.72,21.01 8.72,21.64 C16.2
N$4
  Top 0.152: R6.2 1.9,30.13 CHRG1.5
N$5
  Top 0.152: C16.1 8.9,22.96 9.54,22.32 9.54,20.89 9.77,20.66 9.77,19.38 U3.3
N$7
  Top 0.152: C14.2 10.58,21.74 10.58,19.27 U3.4
N$8
  Top 0.152: C14.1 10.65,23.02 11.33,22.34 11.33,19.29 U3.5
N$11
  Top 0.152: U2.12 9.63,5.52 9.74,5.41 R10.2
N$12
  Top 0.152: U2.11 R11.2
N$13
  Top 0.152: U3.28 27.4,20.23 27.75,20.58 29.7,20.58 29.92,20.36 C13.2
N$14
  Top 0.152: R14.2 LED3.C
N$15
  Top 0.152: C15.2 26.98,15.2 26.98,15.21 26.7,15.49 U3.27
N$16
  Top 0.152: R15.2 11.96,10.21 LED4.C
N$26
  Top 0.152: C3.2 17.11,22 17.52,21.58 20.31,21.58 XTAL1.P$1 21.12,21.05 22.95,21.05 23.17,21.27 U1.13
N$27
  Top 0.152: U1.14 23.87,23.14 23.68,23.34 20.46,23.34 XTAL1.P$2 20.26,23.33 19.38,22.45 C4.1
N$28
  Top 0.152: R4.1 33.95,21.65 LED1.A
N$29
  Top 0.152: R5.1 35.75,22.98 LED2.A
N$30
  Top 0.457: U1.10 22.02,25 19.93,25 19.46,25.47 18.62,25.47 16.54,27.55 L1.1
N$31
  Top 0.457: U1.9 22.01,25.71 20.37,25.71 18.24,27.83 L1.2 C1.1
RESET  (via drill 0.35)
  Top 0.152: C10.2 36.12,9.62 36.12,10.99 D3.+ 36.09,11.23 36.09,12.59 R9.1 35.89,12.93 36.52,13.56 36.52,16.98 36.14,17.36 35.68,17.36 35.83,17.5 RESET.1 36.9,18.92 36.9,26.15 36.09,26.96 DEBUG1.10 | v32.68,30.55 U1.35
  Bottom 0.152: v32.68,30.55 32.68,30.19 33.61,29.26 33.61,26.88 34.29,26.2 35.21,26.2 36.01,27.01 DEBUG1.10
RXD.FT
  Top 0.152: U2.4 3.24,8.66 4.51,8.66 8.25,12.4 17.45,12.4 18.53,11.32 R17.1
RXD.NRF  (via drill 0.35)
  Top 0.152: U1.21 28.77,24.03 v28.16,24.64 | v22.84,9.15 21.07,9.15 R16.2
  Bottom 0.152: v28.16,24.64 28.16,24.25 22.03,18.12 21.02,18.12 19.86,16.95 19.86,16.19 23.53,12.52 23.53,9.84 v22.84,9.15
RXLED
  Top 0.152: U2.17 R14.1
SCK  (via drill 0.35)
  Top 0.152: U3.18 20.4,16.51 v20.46,16.44 | v29.88,24.09 30.04,24.25 U1.26
  Bottom 0.152: v20.46,16.44 22.6,16.44 29.47,23.32 29.47,23.68 v29.88,24.09
SCL  (via drill 0.35)
  Top 0.152: U1.3 21.92,29.99 21.25,29.99 20.42,30.83 v20.42,31.07 | R2.1 3.55,32.9 4.22,32.23 5.84,32.23 6.27,32.66 J1.2
  Bottom 0.152: J1.2 6.27,33.41 6.91,34.05 18.4,34.05 20.42,32.03 v20.42,31.07
SDA  (via drill 0.35)
  Top 0.152: U1.2 22.07,31.14 v21.05,32.16 | J1.1 4.81,33 4.09,33.72 2.14,33.72 1.6,33.19 R1.1
  Bottom 0.152: J1.1 6.58,34.58 18.93,34.58 21.05,32.46 v21.05,32.16
SWCLK
  Top 0.152: DEBUG1.4 36.09,30.96 36.88,31.75 36.88,32.41 36.4,32.89 34.12,32.89 32.48,31.25 U1.36
SWDIO  (via drill 0.35)
  Top 0.152: U1.37 32.31,31.95 v32.85,32.49 v32.85,32.5
  Bottom 0.152: DEBUG1.2 35.94,32.09 35.09,32.94 34.13,32.94 33.85,32.65 33.01,32.65 v32.85,32.5
SWO  (via drill 0.35)
  Top 0.152: U1.32 v32.68,28.45 v32.69,28.44
  Bottom 0.152: v32.69,28.44 32.69,26.4 33.26,25.82 36.29,25.82 36.9,26.44 36.9,29.14 36.5,29.55 DEBUG1.6
TXD.FT
  Top 0.152: R16.1 19.12,9.04 16.1,12.06 9.15,12.06 8.56,11.47 U2.20
TXD.NRF  (via drill 0.35)
  Top 0.152: U1.19 27.37,23.9 v26.94,24.33 | v22.1,11.3 20.62,11.3 R17.2
  Bottom 0.152: v22.1,11.3 22.1,13.09 19.2,15.98 19.2,17.2 20.75,18.75 21.98,18.75 26.57,23.35 26.57,23.96 v26.94,24.33
TXLED  (via drill 0.35)
  Top 0.152: v7.25,10.28 7.25,8.94 4,5.69 4,5.24 3.86,5.11 3.41,5.11 U2.10 | v9.42,11.42 10.16,10.68 R15.1
  Bottom 0.152: v7.25,10.28 7.77,10.79 7.79,10.79 8.42,11.42 v9.42,11.42
USB+  (via drill 0.35)
  Top 0.152: C11.1 11.81,3.74 10.4,3.74 | 10.4,3.74 R11.1 | v6.64,7.32 6.84,7.12 6.84,3.55 7.86,2.54 9.19,2.54 10.4,3.74
  Bottom 0.152: v6.64,7.32 6.11,7.32 5.5,6.71 USB1.3
USB-  (via drill 0.35)
  Top 0.152: R10.1 11.9,5.42 12.13,5.65 13.16,5.65 13.49,5.41 C9.2 14.8,5.39 14.8,2.42 14.08,1.7 6.83,1.7 6.24,2.29 6.24,6.33 v6.24,6.34
  Bottom 0.152: USB1.2 4.79,6.08 5.89,6.08 6.16,6.34 v6.24,6.34
V_USB  (via drill 0.35)
  Top 0.152: U2.15 8.54,7.41 8.49,7.46 7.9,7.46 7.46,7.01 v7.46,6.67
  Bottom 0.152: v7.46,6.67 7.46,5.99 D2.+
  Bottom 0.406: USB1.1 6.32,5.41 D2.+
VIN  (via drill 0.35)
  Top 0.152: R3.2 6.93,29.94 C5.2 | LDO1.3 9.75,25.35 8.79,24.39 7.7,24.39 7.21,24.88 7.21,28.15
  Top 0.66: CHRG1.4 4.99,28.46 C5.2 5.31,28.15 6.6,28.15 | 6.6,28.15 v6.61,28.14 | LDO1.1 9.86,27.17 C6.2 7.21,28.15 6.6,28.15
  Bottom 0.61: D2.- D1.-
  Bottom 0.66: v6.61,28.14 6.61,24.62 5.08,23.09 5.08,17.64 10.67,12.06 10.67,4.34 9.41,3.08 D1.-
VLIPO  (via drill 0.35)
  Top 0.152: R7.2 4.3,17.15 J2.2
  Top 0.66: CHRG1.3 3.79,24.36 C8.1 3.71,24.21 v3.71,23.05
  Bottom 0.61: J2.2 2,14.79 4.97,14.79
  Bottom 0.66: v3.71,23.05 3.85,22.91 3.85,16.02 2.64,14.81 J2.2 | D1.+ 8.47,5.41 8.47,8.34 7.71,9.1 7.21,9.1 6.39,9.92 6.39,13.37 4.97,14.79

### Text on the board
tNames: +
bNames: +